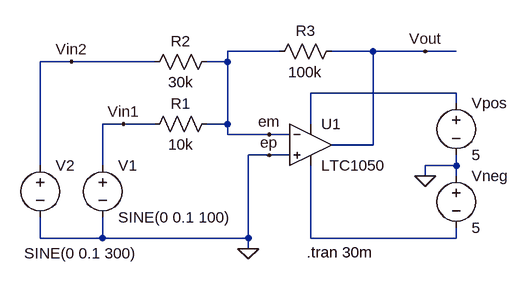
[diagram p0: schematic adder.asc]
adder.asc, the LTspice schematic file:
Version 4
SHEET 1 880 680
WIRE 176 48 96 48
WIRE 320 48 256 48
WIRE 400 48 320 48
WIRE 448 48 400 48
WIRE -144 64 -192 64
WIRE -16 64 -144 64
WIRE 96 64 96 48
WIRE 96 64 64 64
WIRE 448 112 224 112
WIRE 448 128 448 112
WIRE -64 160 -96 160
WIRE -16 160 -64 160
WIRE 96 160 96 64
WIRE 96 160 64 160
WIRE 224 160 224 112
WIRE 96 176 96 160
WIRE 160 176 96 176
WIRE 192 176 160 176
WIRE 320 192 320 48
WIRE 320 192 256 192
WIRE 160 208 128 208
WIRE 192 208 160 208
WIRE -192 224 -192 64
WIRE -96 224 -96 160
WIRE 448 224 448 208
WIRE 448 224 400 224
WIRE 400 240 400 224
WIRE 448 240 448 224
WIRE -192 336 -192 304
WIRE -96 336 -96 304
WIRE -96 336 -192 336
WIRE 128 336 128 208
WIRE 128 336 -96 336
WIRE 224 336 224 224
WIRE 448 336 448 320
WIRE 448 336 224 336
WIRE 128 352 128 336
FLAG 128 352 0
FLAG 400 240 0
FLAG 400 48 Vout
FLAG 160 176 em
FLAG 160 208 ep
FLAG -144 64 Vin2
FLAG -64 160 Vin1
SYMBOL Opamps\\LTC1050 224 128 R0
SYMATTR InstName U1
SYMBOL res 272 32 R90
WINDOW 0 0 56 VBottom 2
WINDOW 3 32 56 VTop 2
SYMATTR InstName R3
SYMATTR Value 100k
SYMBOL res 80 48 R90
WINDOW 0 0 56 VBottom 2
WINDOW 3 32 56 VTop 2
SYMATTR InstName R2
SYMATTR Value 30k
SYMBOL res 80 144 R90
WINDOW 0 0 56 VBottom 2
WINDOW 3 32 56 VTop 2
SYMATTR InstName R1
SYMATTR Value 10k
SYMBOL voltage 448 112 R0
SYMATTR InstName Vpos
SYMATTR Value 5
SYMBOL voltage 448 224 R0
SYMATTR InstName Vneg
SYMATTR Value 5
SYMBOL voltage -96 208 R0
WINDOW 123 0 0 Left 2
WINDOW 39 0 0 Left 2
SYMATTR InstName V1
SYMATTR Value SINE(0 0.1 100)
SYMBOL voltage -192 208 R0
WINDOW 3 -25 151 Left 2
WINDOW 123 0 0 Left 2
WINDOW 39 0 0 Left 2
SYMATTR InstName V2
SYMATTR Value SINE(0 0.1 300)
TEXT 218 358 Left 2 !.tran 30m

The netlist it stands for:
* adder.asc
XU1 0 em N001 N002 Vout LTC1050  ; pins In+ In- V+ V- OUT
R3 Vout em 100k
R2 em Vin2 30k
R1 em Vin1 10k
Vpos N001 0 5
Vneg 0 N002 5
V1 Vin1 0 SINE(0 0.1 100)
V2 Vin2 0 SINE(0 0.1 300)
.tran 30m
.lib LTC.lib
.backanno
.end